# Altium schematic sheet 31_Power2.SchDoc: Board power supply 2
size A3; Organization: Lime Microsystems; Address1: Surrey Tech Centre; Address2: Guildford GU2 7YG; Address3: Surrey; Address4: United Kingdom; Revision: v1.1; SheetNumber: 31; SheetTotal: 31
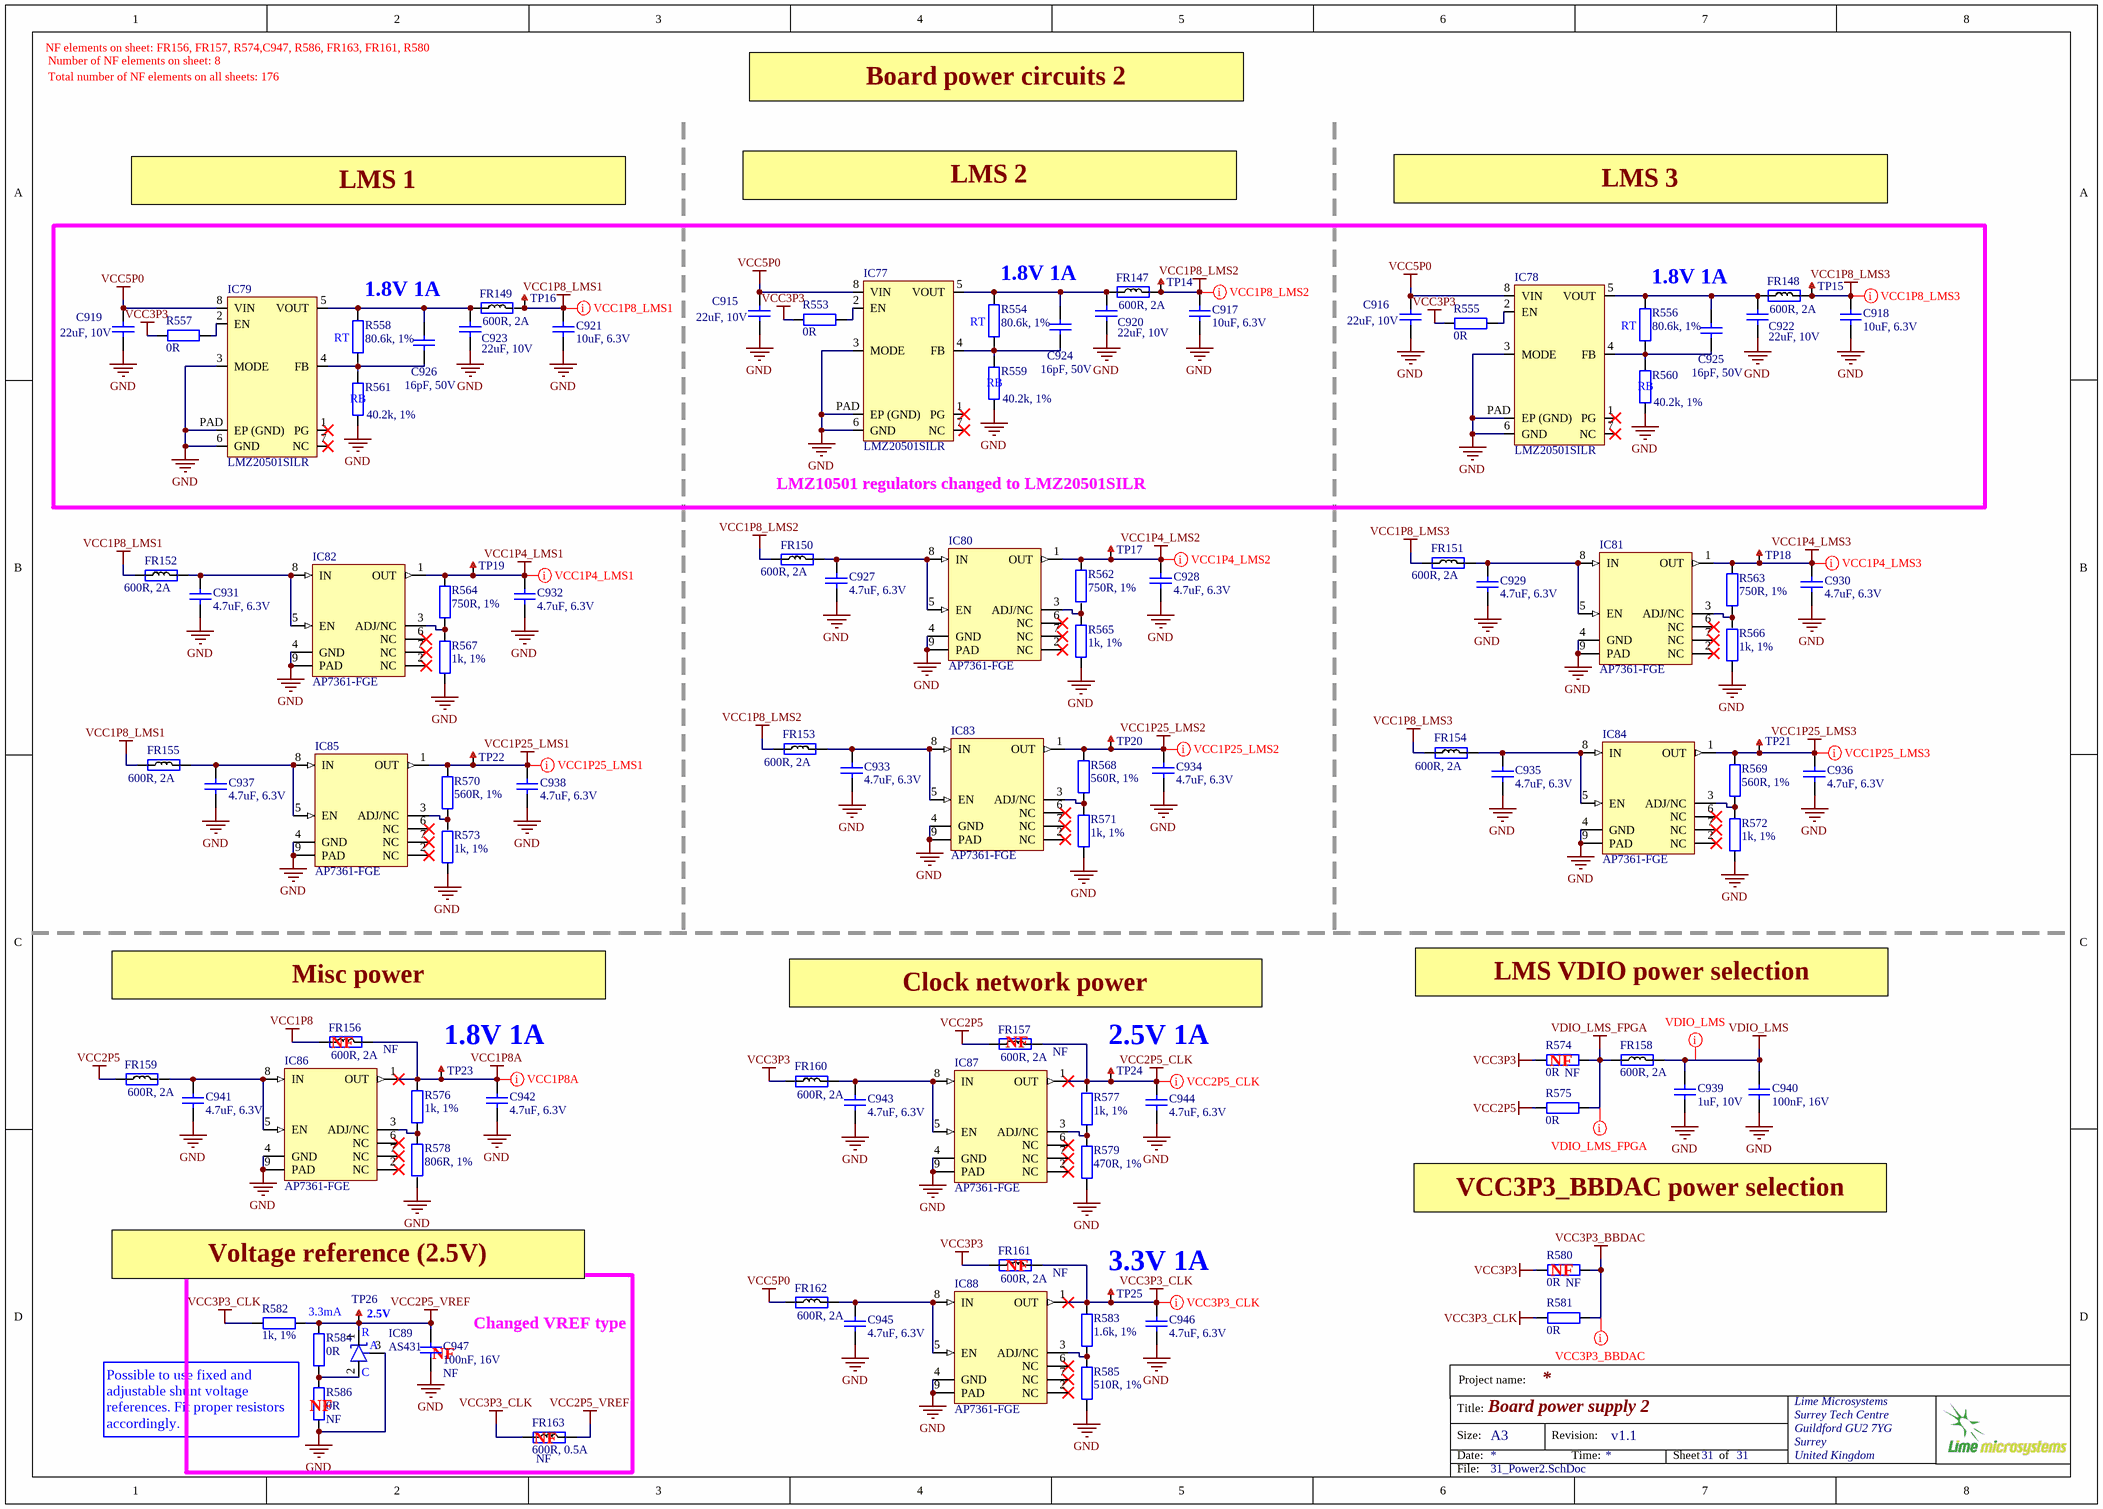
[diagram p0: 31_Power2.SchDoc]

## Parts
C915  22uF, 10V  [CAP0603]
C916  22uF, 10V  [CAP0603]
C917  10uF, 6.3V  [CAP0603]
C918  10uF, 6.3V  [CAP0603]
C919  22uF, 10V  [CAP0603]
C920  22uF, 10V  [CAP0603]
C921  10uF, 6.3V  [CAP0603]
C922  22uF, 10V  [CAP0603]
C923  22uF, 10V  [CAP0603]
C924  16pF, 50V  [CAP0402]
C925  16pF, 50V  [CAP0402]
C926  16pF, 50V  [CAP0402]
C927  4.7uF, 6.3V  [CAP0402]
C928  4.7uF, 6.3V  [CAP0402]
C929  4.7uF, 6.3V  [CAP0402]
C930  4.7uF, 6.3V  [CAP0402]
C931  4.7uF, 6.3V  [CAP0402]
C932  4.7uF, 6.3V  [CAP0402]
C933  4.7uF, 6.3V  [CAP0402]
C934  4.7uF, 6.3V  [CAP0402]
C935  4.7uF, 6.3V  [CAP0402]
C936  4.7uF, 6.3V  [CAP0402]
C937  4.7uF, 6.3V  [CAP0402]
C938  4.7uF, 6.3V  [CAP0402]
C939  1uF, 10V  [CAP0402]
C940  100nF, 16V  [CAP0402]
C941  4.7uF, 6.3V  [CAP0402]
C942  4.7uF, 6.3V  [CAP0402]
C943  4.7uF, 6.3V  [CAP0402]
C944  4.7uF, 6.3V  [CAP0402]
C945  4.7uF, 6.3V  [CAP0402]
C946  4.7uF, 6.3V  [CAP0402]
C947  100nF, 16V  Assembly Info: NF  [CAP0402]
FR147  600R, 2A  [RES0805]
FR148  600R, 2A  [RES0805]
FR149  600R, 2A  [RES0805]
FR150  600R, 2A  [RES0805]
FR151  600R, 2A  [RES0805]
FR152  600R, 2A  [RES0805]
FR153  600R, 2A  [RES0805]
FR154  600R, 2A  [RES0805]
FR155  600R, 2A  [RES0805]
FR156  600R, 2A  Assembly Info: NF  [RES0805]
FR157  600R, 2A  Assembly Info: NF  [RES0805]
FR158  600R, 2A  [RES0805]
FR159  600R, 2A  [RES0805]
FR160  600R, 2A  [RES0805]
FR161  600R, 2A  Assembly Info: NF  [RES0805]
FR162  600R, 2A  [RES0805]
FR163  value 600R, 0.5A  Assembly Info: NF  [RES0402]  (hidden comment: Ferrite)
IC77  LMZ20501SILR  [LMZ20501SILR_DC-DC_8-SMD]
IC78  LMZ20501SILR  [LMZ20501SILR_DC-DC_8-SMD]
IC79  LMZ20501SILR  [LMZ20501SILR_DC-DC_8-SMD]
IC80  AP7361-FGE  [AP7361]
IC81  AP7361-FGE  [AP7361]
IC82  AP7361-FGE  [AP7361]
IC83  AP7361-FGE  [AP7361]
IC84  AP7361-FGE  [AP7361]
IC85  AP7361-FGE  [AP7361]
IC86  AP7361-FGE  [AP7361]
IC87  AP7361-FGE  [AP7361]
IC88  AP7361-FGE  [AP7361]
IC89  AS431  [SOT23-3_v2]
R553  0R  [RES0402]
R554  80.6k, 1%  [RES0402]
R555  0R  [RES0402]
R556  80.6k, 1%  [RES0402]
R557  0R  [RES0402]
R558  80.6k, 1%  [RES0402]
R559  40.2k, 1%  [RES0402]
R560  40.2k, 1%  [RES0402]
R561  40.2k, 1%  [RES0402]
R562  750R, 1%  [RES0402]
R563  750R, 1%  [RES0402]
R564  750R, 1%  [RES0402]
R565  1k, 1%  [RES0402]
R566  1k, 1%  [RES0402]
R567  1k, 1%  [RES0402]
R568  560R, 1%  [RES0402]
R569  560R, 1%  [RES0402]
R570  560R, 1%  [RES0402]
R571  1k, 1%  [RES0402]
R572  1k, 1%  [RES0402]
R573  1k, 1%  [RES0402]
R574  0R  Assembly Info: NF  [RES0402]
R575  0R  [RES0402]
R576  1k, 1%  [RES0402]
R577  1k, 1%  [RES0402]
R578  806R, 1%  [RES0402]
R579  470R, 1%  [RES0402]
R580  0R  Assembly Info: NF  [RES0402]
R581  0R  [RES0402]
R582  1k, 1%  [RES0402]
R583  1.6k, 1%  [RES0402]
R584  0R  [RES0402]
R585  510R, 1%  [RES0402]
R586  0R  Assembly Info: NF  [RES0402]
TP14  TESTPOINT_PAD  [TP_PAD_1p5MM]  (value not drawn)  (no BOM)
TP15  TESTPOINT_PAD  [TP_PAD_1p5MM]  (value not drawn)  (no BOM)
TP16  TESTPOINT_PAD  [TP_PAD_1p5MM]  (value not drawn)  (no BOM)
TP17  TESTPOINT_PAD  [TP_PAD_1p5MM]  (value not drawn)  (no BOM)
TP18  TESTPOINT_PAD  [TP_PAD_1p5MM]  (value not drawn)  (no BOM)
TP19  TESTPOINT_PAD  [TP_PAD_1p5MM]  (value not drawn)  (no BOM)
TP20  TESTPOINT_PAD  [TP_PAD_1p5MM]  (value not drawn)  (no BOM)
TP21  TESTPOINT_PAD  [TP_PAD_1p5MM]  (value not drawn)  (no BOM)
TP22  TESTPOINT_PAD  [TP_PAD_1p5MM]  (value not drawn)  (no BOM)
TP23  TESTPOINT_PAD  [TP_PAD_1p5MM]  (value not drawn)  (no BOM)
TP24  TESTPOINT_PAD  [TP_PAD_1p5MM]  (value not drawn)  (no BOM)
TP25  TESTPOINT_PAD  [TP_PAD_1p5MM]  (value not drawn)  (no BOM)
TP26  TESTPOINT_PAD  [TP_PAD_1p5MM]  (value not drawn)  (no BOM)

## Blocks framed on the sheet
Changed VREF type: C947 FR163 IC89 R582 R584 R586 TP26

## Nets
GND: C915.1 C916.1 C917.1 C918.1 C919.1 C920.1 C921.1 C922.1 C923.1 C927.1 C928.1 C929.1 C930.1 C931.1 C932.1 C933.1 C934.1 C935.1 C936.1 C937.1 C938.1 C939.1 C940.2 C941.1 C942.1 C943.1 C944.1 C945.1 C946.1 C947.1 IC77.3(MODE) IC77.6(GND) IC77.PAD(EP_(GND)) IC78.3(MODE) IC78.6(GND) IC78.PAD(EP_(GND)) IC79.3(MODE) IC79.6(GND) IC79.PAD(EP_(GND)) IC80.4(GND) IC80.9(PAD) IC81.4(GND) IC81.9(PAD) IC82.4(GND) IC82.9(PAD) IC83.4(GND) IC83.9(PAD) IC84.4(GND) IC84.9(PAD) IC85.4(GND) IC85.9(PAD) IC86.4(GND) IC86.9(PAD) IC87.4(GND) IC87.9(PAD) IC88.4(GND) IC88.9(PAD) IC89.3(NC/A) R559.1 R560.1 R561.1 R565.1 R566.1 R567.1 R571.1 R572.1 R573.1 R578.2 R579.2 R585.2 R586.2
VCC1P4_LMS1: C932.2 IC82.1(OUT) R564.1 TP19.1
VCC1P4_LMS2: C928.2 IC80.1(OUT) R562.1 TP17.1
VCC1P4_LMS3: C930.2 IC81.1(OUT) R563.1 TP18.1
VCC1P8: FR156.1
VCC1P8_LMS1: C921.2 FR149.2 FR152.1 FR155.1 TP16.1
VCC1P8_LMS2: C917.2 FR147.2 FR150.1 FR153.1 TP14.1
VCC1P8_LMS3: C918.2 FR148.2 FR151.1 FR154.1 TP15.1
VCC1P8A: C942.2 FR156.2 IC86.1(OUT) R576.2 TP23.1
VCC1P25_LMS1: C938.2 IC85.1(OUT) R570.2 TP22.1
VCC1P25_LMS2: C934.2 IC83.1(OUT) R568.2 TP20.1
VCC1P25_LMS3: C936.2 IC84.1(OUT) R569.2 TP21.1
VCC2P5: FR157.1 FR159.1 R575.2
VCC2P5_CLK: C944.2 FR157.2 IC87.1(OUT) R577.2 TP24.1
VCC2P5_VREF: C947.2 FR163.2 IC89.1(K) R582.1 R584.1 TP26.1
VCC3P3: FR160.1 FR161.1 R553.1 R555.1 R557.1 R574.2 R580.2
VCC3P3_BBDAC: R580.1 R581.1
VCC3P3_CLK: C946.2 FR161.2 FR163.1 IC88.1(OUT) R581.2 R582.2 R583.2 TP25.1
VCC5P0: C915.2 C916.2 C919.2 FR162.1 IC77.8(VIN) IC78.8(VIN) IC79.8(VIN)
VDIO_LMS: C939.2 C940.1 FR158.2
VDIO_LMS_FPGA: FR158.1 R574.1 R575.1
NetC920_2: C920.2 C924.1 FR147.1 IC77.5(VOUT) R554.2
NetC922_2: C922.2 C925.1 FR148.1 IC78.5(VOUT) R556.2
NetC923_2: C923.2 C926.1 FR149.1 IC79.5(VOUT) R558.2
NetC924_2: C924.2 IC77.4(FB) R554.1 R559.2
NetC925_2: C925.2 IC78.4(FB) R556.1 R560.2
NetC926_2: C926.2 IC79.4(FB) R558.1 R561.2
NetC927_2: C927.2 FR150.2 IC80.5(EN) IC80.8(IN)
NetC929_2: C929.2 FR151.2 IC81.5(EN) IC81.8(IN)
NetC931_2: C931.2 FR152.2 IC82.5(EN) IC82.8(IN)
NetC933_2: C933.2 FR153.2 IC83.5(EN) IC83.8(IN)
NetC935_2: C935.2 FR154.2 IC84.5(EN) IC84.8(IN)
NetC937_2: C937.2 FR155.2 IC85.5(EN) IC85.8(IN)
NetC941_2: C941.2 FR159.2 IC86.5(EN) IC86.8(IN)
NetC943_2: C943.2 FR160.2 IC87.5(EN) IC87.8(IN)
NetC945_2: C945.2 FR162.2 IC88.5(EN) IC88.8(IN)
NetIC77_2: IC77.2(EN) R553.2
NetIC78_2: IC78.2(EN) R555.2
NetIC79_2: IC79.2(EN) R557.2
NetIC80_3: IC80.3(ADJ/NC) R562.2 R565.2
NetIC81_3: IC81.3(ADJ/NC) R563.2 R566.2
NetIC82_3: IC82.3(ADJ/NC) R564.2 R567.2
NetIC83_3: IC83.3(ADJ/NC) R568.1 R571.2
NetIC84_3: IC84.3(ADJ/NC) R569.1 R572.2
NetIC85_3: IC85.3(ADJ/NC) R570.1 R573.2
NetIC86_3: IC86.3(ADJ/NC) R576.1 R578.1
NetIC87_3: IC87.3(ADJ/NC) R577.1 R579.1
NetIC88_3: IC88.3(ADJ/NC) R583.1 R585.1
NetIC89_2: IC89.2(A) R584.2 R586.1

Not connected (* = marked no-connect by the designer): IC77 1(PG)* 7(NC)*; IC78 1(PG)* 7(NC)*; IC79 1(PG)* 7(NC)*; IC80 2(NC)* 6(NC)* 7(NC)*; IC81 2(NC)* 6(NC)* 7(NC)*; IC82 2(NC)* 6(NC)* 7(NC)*; IC83 2(NC)* 6(NC)* 7(NC)*; IC84 2(NC)* 6(NC)* 7(NC)*; IC85 2(NC)* 6(NC)* 7(NC)*; IC86 2(NC)* 6(NC)* 7(NC)*; IC87 2(NC)* 6(NC)* 7(NC)*; IC88 2(NC)* 6(NC)* 7(NC)*

## Layout directives
net class VCC1P4_LMS1: VCC1P4_LMS1
net class VCC1P25_LMS1: VCC1P25_LMS1
net class VCC1P4_LMS2: VCC1P4_LMS2
net class VCC1P25_LMS2: VCC1P25_LMS2
net class VDIO_LMS: VDIO_LMS
net class VDIO_LMS_FPGA: VDIO_LMS_FPGA
net class VCC1P4_LMS3: VCC1P4_LMS3
net class VCC1P25_LMS3: VCC1P25_LMS3
net class VCC1P8A: VCC1P8A
net class VCC3P3_CLK: VCC3P3_CLK
net class VCC2P5_CLK: VCC2P5_CLK
net class VCC3P3_BBDAC: VCC3P3_BBDAC
net class VCC1P8_LMS1: VCC1P8_LMS1
net class VCC1P8_LMS2: VCC1P8_LMS2
net class VCC1P8_LMS3: VCC1P8_LMS3

## Notes on the sheet
- NF elements on sheet: FR156, FR157, R574,C947, R586, FR163, FR161, R580
- Number of NF elements on sheet: 8
- Total number of NF elements on all sheets: 176
- Board power circuits 2
- LMS 1
- LMS 2
- LMS 3
- (near R558) 1.8V 1A
- (near R554) 1.8V 1A
- (near R556) 1.8V 1A
- RT
- (near R561) RB
- (near R559) RB
- (near R560) RB
- LMZ10501 regulators changed to LMZ20501SILR
- LMS VDIO power selection
- Misc power
- (near FR156) NF
- (near TP23) 1.8V 1A
- (near FR157) Clock network power
- (near FR157) NF
- (near TP24) 2.5V 1A
- (near R574) NF
- VCC3P3_BBDAC power selection
- Voltage reference (2.5V)
- 3.3mA
- (near TP26) 2.5V
- (near FR161) NF
- (near TP25) 3.3V 1A
- (near R580) NF
- (near IC89) C
- (near IC89) R
- (near IC89) A
- (near C947) NF
- Possible to use fixed and adjustable shunt voltage references. Fit proper resistors accordingly.
- (near R586) NF
- (near FR163) NF
- Project name:
- Title:
- Size:
- Date:
- A3
- Revision:
- Time:
- Sheet
- of
- File:

## Library data of the parts
C915 C916 C919 C920 C922 C923 = Cap_0603: Manufacturer Part Number 1: C1608X5R1A226M080AC; Manufacturer: TDK Corporation; Part Description: 22µF ±20% 10V X5R Ceramic Capacitor -55°C ~ 85°C Surface Mount, MLCC 0603 (1608 Metric) 0.063" L x 0.031" W (1.60mm x 0.80mm); Brand: TDK; Temperature Coefficient / Code: +/- 15 %; Tolerance: 20 %; Type: Multilayer Ceramic Chip Capacitor; Supplier 1: Mouser; Supplier Part Number 1: 810-C1608X5R1A226M; Package / Case: 0603 (1608 metric); Category: Multilayer Ceramic Capacitors MLCC - SMD/SMT; Capacitance: 22 uF; Operating Temperature Range: - 55 C to + 85 C; Case Code - in: 0603; Voltage Rating DC: 10 V; Case Code - mm: 1608; Value: 22uF, 10V
C917 C918 C921 = Cap_0603: Manufacturer Part Number 1: CC0603MRX5R5BB106; Manufacturer: Yageo; Part Description: 10µF ±20% 6.3V X5R Ceramic Capacitor -55°C ~ 85°C Surface Mount, MLCC 0603 (1608 Metric) 0.063" L x 0.031" W (1.60mm x 0.80mm); Capacitance: 10µF; Tolerance: ±20%; Supplier 1: Digi-Key; Supplier Part Number 1: 311-1448-2-ND; Package / Case: 0603 (1608 Metric); Category: Capacitors; Voltage - Rated: 6.3V; Value: 10uF, 6.3V
C924-C926 = Cap_0402: Part Description: 16 pF ±5% 50V Ceramic Capacitor C0G, NP0 0402 (1005 Metric); Manufacturer: Yageo; Manufacturer Part Number 1: CC0402JRNPO9BN160; Tolerance: 5%; Dielectric: C0G; Value: 16pF, 50V; Supplier 1: Digi-Key; Supplier Part Number 1: 311-1662-1-ND; Stock 1: 168271; Pricing 1: 1=0,10000, 10=0,03700, 50=0,02020, 100=0,01640, 500=0,01174, 1000=0,00922, 2500=0,00838, 5000=0,00771 (USD); RoHS: Yes; Mount: Surface Mount; Case/Package: 0402; Case Code (Imperial): 0402; Case Code (Metric): 1005; Weight: 2.3E-05oz; Min Operating Temperature: -55°C; Max Operating Temperature: 125°C; Capacitance: 16pF; Packaging: Tape and Reel; Voltage Rating (DC): 50V; Voltage Rating: 50V; Termination: SMD/SMT; Resistor Type: Ceramic; Series: CC; Length: 0.039inch; Width: 0.02inch; Thickness: 0.022inch; Depth: 0.5mm; Lead Free: Lead Free; RoHS Compliant: Yes; ComponentLink1URL: http://www.mouser.com/ds/2/447/Yageo_UPY-GP_NP0_16V-to-50V_9-358835.pdf?src-supplier=Mouser; ComponentLink1Description: http://www.mouser.com/ds/2/447/Yageo_UPY-GP_NP0_16V-to-50V_9-358835.pdf?src-supplier=Mouser; ComponentLink2URL: http://www.yageo.com/documents/recent/UPY-GP_NP0_16V-to-50V_16.pdf?src-supplier=Digi-Key; ComponentLink2Description: http://www.yageo.com/documents/recent/UPY-GP_NP0_16V-to-50V_16.pdf?src-supplier=Digi-Key
C927-C938 C943-C946 = Cap_0402: Manufacturer: Murata Electronics North America; Manufacturer Part Number 1: GRM155R60J475ME87D; Part Description: 4.7µF ±20% 6.3V X5R Ceramic Capacitor -55°C ~ 85°C Surface Mount, MLCC 0402 (1005 Metric) 0.039" L x 0.020" W (1.00mm x 0.50mm); Tolerance: ±20%; Capacitance: 4.7µF; Temperature Coefficient: X5R; Lead Style: -; Ratings: -; Height - Seated (Max): -; Thickness (Max): 0.022" (0.55mm); Voltage - Rated: 6.3V; Packaging: Cut Tape (CT); Lead Spacing: -; Category: Capacitors; Supplier Part Number 1: 490-5408-1-ND; Applications: General Purpose; Operating Temperature: -55°C ~ 85°C; Mounting Type: Surface Mount, MLCC; Features: Derating Recommended; RoHS: RoHS Compliant; Supplier 1: Digi-Key; Package / Case: 0402 (1005 Metric); Size / Dimension: 0.039" L x 0.020" W (1.00mm x 0.50mm); Value: 4.7uF, 6.3V
C939 = Cap_0402: Manufacturer Part Number 1: C1005X5R1E105K050BC; Manufacturer: TDK; Part Description: 1µF ±10% 10V X5R Ceramic Capacitor -55°C ~ 85°C Surface Mount, MLCC 0402 (1005 Metric) 0.039" L x 0.020" W (1.00mm x 0.50mm); Voltage Rating: 10; Capacitance Tolerance: ± 10%; Product Range: TDK - C Series; Ceramic Capacitor Case: 0402 [1005 Metric]; Capacitance: 1; Dielectric Characteristic: X6; Value: 1uF, 10V; Supplier 1: Digi-Key; Supplier Part Number 1: 445-9066-1-ND; MSL: -; RoHS: YES
C940 = Cap_0402: Manufacturer: Murata Electronics; Manufacturer Part Number 1: GRM155R71C104KA88D; Part Description: 0.10µF ±10% 16V X7R Ceramic Capacitor -55°C ~ 125°C Surface Mount, MLCC 0402 (1005 Metric) 0.039" L x 0.020" W (1.00mm x 0.50mm); Tolerance: 10 %; Type: General Purpose MLCC; Capacitance: 0.1 uF; Case Length: 1 mm; Dielectric: X7R; Case Height: 0.5 mm; Temperature Coefficient / Code: +/- 15 %; Value: 100nF, 16V; Supplier 1: Mouser; Supplier Part Number 1: 81-GRM155R71C104KA88; Case Code - in: 0402; RoHS: RoHS Compliant; Operating Temperature Range: - 55 C to + 125 C; Series: GRM; Termination Style: SMD/SMT; Package / Case: 0402 (1005 metric); Voltage Rating DC: 16 V; Maximum Operating Temperature: + 125 C; Case Code - mm: 1005; Minimum Operating Temperature: - 55 C; Product Category: Low & Medium Capacitance SMD Ceramic Chip Capacitors; Packaging: Reel; Product: General Type MLCCs; Category: Multilayer Ceramic Capacitors MLCC - SMD/SMT; Brand: Murata Electronics; Case Width: 0.5 mm; RoHS - Mouser: Y; Standard Pack Qty: 10000; Minimum Order Quantity: 1; Reeling: True
C941 C942 = Cap_0402: Manufacturer Part Number 1: GRM155R60J475ME87D; Manufacturer: Murata Electronics North America; Part Description: 4.7µF ±20% 6.3V X5R Ceramic Capacitor -55°C ~ 85°C Surface Mount, MLCC 0402 (1005 Metric) 0.039" L x 0.020" W (1.00mm x 0.50mm); Temperature Coefficient: X5R; Capacitance: 4.7µF; Tolerance: ±20%; Value: 4.7uF, 6.3V; Supplier 1: Digi-Key; Supplier Part Number 1: 490-5408-1-ND; Category: Capacitors; Voltage - Rated: 6.3V; Thickness (Max): 0.022" (0.55mm); Applications: General Purpose; Package / Case: 0402 (1005 Metric); Size / Dimension: 0.039" L x 0.020" W (1.00mm x 0.50mm); Features: Derating Recommended; Mounting Type: Surface Mount, MLCC; Ratings: -; Lead Style: -; Operating Temperature: -55°C ~ 85°C; Lead Spacing: -; RoHS: RoHS Compliant; Height - Seated (Max): -; Packaging: Cut Tape (CT)
C947 = Cap_0603: Manufacturer Part Number 1: GRM155R71C104KA88D; Part Description: 0.10µF ±10% 16V X7R Ceramic Capacitor -55°C ~ 125°C Surface Mount, MLCC 0402 (1005 Metric) 0.039" L x 0.020" W (1.00mm x 0.50mm); Brand: Murata Electronics; Tolerance: 10 %; Type: General Purpose MLCC; Capacitance: 0.1 uF; Temperature Coefficient / Code: +/- 15 %; Case Height: 0.5 mm; Case Length: 1 mm; Dielectric: X7R; Supplier 1: Mouser; Supplier Part Number 1: 81-GRM155R71C104KA88; Case Code - in: 0402; Manufacturer: Murata Electronics; Category: Multilayer Ceramic Capacitors MLCC - SMD/SMT; Voltage Rating DC: 16 V; Value: 100nF, 16V; Case Code - mm: 1005; Case Width: 0.5 mm; Maximum Operating Temperature: + 125 C; Minimum Operating Temperature: - 55 C; Minimum Order Quantity: 1; Operating Temperature Range: - 55 C to + 125 C; Package / Case: 0402 (1005 metric); Packaging: Reel; Product: General Type MLCCs; Product Category: Low & Medium Capacitance SMD Ceramic Chip Capacitors; Reeling: True; RoHS - Mouser: Y; RoHS: RoHS Compliant; Series: GRM; Standard Pack Qty: 10000; Termination Style: SMD/SMT
FR147-FR162 = Ferrite: Manufacturer Part Number 1: MPZ2012S601AT000; Manufacturer: TDK Corporation; Part Description: FERRITE BEAD 600 OHM 0805 1LN; Filter Type: Differential Mode - Single; Impedance @ Frequency: 600 Ohm @ 100MHz; DC Resistance (DCR): 100 mOhm Max; Supplier 1: Digi-Key; Supplier Part Number 1: 445-2206-2-ND; Mounting Type: Surface Mount; RoHS: RoHS Compliant; Height (Max): 0.041" (1.05mm); Packaging: Tape & Reel (TR); Category: Filters; Current Rating: 2A; Package / Case: 0805 (2012 Metric); Size / Dimension: 0.079" L x 0.049" W (2.00mm x 1.25mm); Value: 600R, 2A
FR163 = Ferrite: Manufacturer: Murata; Manufacturer Part Number 1: BLM15AX601SN1D; Part Description: - Ferrite Bead 0402 (1005 Metric) 500mA 340mOhm; Tolerance: 25%; Impedance: 600R; Current Rating: 500mA; Number of Lines: 1; DC Resistance (DCR): 340mR; Test Frequency: 100MHz; Supplier 1: Digi-Key; Supplier Part Number 1: 490-5441-1-ND; Stock 1: 416370; Pricing 1: 1=0.1, 10=0.06, 25=0.0552, 50=0.0496, 100=0.0363, 250=0.0264, 500=0.0242, 1000=0.0209, 5000=0.0165 (USD); Case/Package: 0402; Number of Pins: 2; Case Code (Metric): 1005; Case Code (Imperial): 0402; Core Material: Ferrite; Material: Steel,Ferrite; Min Operating Temperature: -55°C; Max Operating Temperature: 125°C; Package Quantity: 1; Packaging: Tape and Reel; Series: BLM15AX_SN; Max Current Rating: 500mA; Termination: SMD/SMT; Max DC Current: 500mA; Number of Circuits: 1; DC Resistance-Max: 340mR; Length: 1mm; Width: 0.5mm; Height: 0.5mm; Depth: 0.5mm; REACH SVHC: No SVHC; Lead Free: Lead Free; RoHS Compliant: Yes; ComponentLink1URL: https://www.murata.com/en-us/products/productdata/8796740059166/ENFA0018.pdf?src-supplier=Digi-Key; ComponentLink1Description: https://www.murata.com/en-us/products/productdata/8796740059166/ENFA0018.pdf?src-supplier=Digi-Key; ComponentLink2URL: http://search.murata.co.jp/Ceramy/image/img/PDF/ENG/L0110S0100BLM15AX_SN.pdf?src-supplier=Future+Electronics; ComponentLink2Description: http://search.murata.co.jp/Ceramy/image/img/PDF/ENG/L0110S0100BLM15AX_SN.pdf?src-supplier=Future+Electronics; ComponentLink3URL: http://www.produktinfo.conrad.com/datenblaetter/1100000-1199999/001171675-da-01-en-CHIP_DROSSEL0402_600R_420MA_1_0X0_5MM.pdf?src-supplier=Conrad; ComponentLink3Description: http://www.produktinfo.conrad.com/datenblaetter/1100000-1199999/001171675-da-01-en-CHIP_DROSSEL0402_600R_420MA_1_0X0_5MM.pdf?src-supplier=Conrad; ComponentLink4URL: http://www.produktinfo.conrad.com/datenblaetter/1100000-1199999/001172169-da-01-en-DROSSEL_0402_600R_1_0X0_5MM_10000ST.pdf?src-supplier=Conrad; ComponentLink4Description: http://www.produktinfo.conrad.com/datenblaetter/1100000-1199999/001172169-da-01-en-DROSSEL_0402_600R_1_0X0_5MM_10000ST.pdf?src-supplier=Conrad
IC77-IC79 = LMZ20501SILR_DC-DC: Manufacturer: Texas Instruments; Part Description: Non-Isolated PoL Module DC DC Converter 1 Output 0.8 ~ 3.6V 1A 2.7V - 5.5V Input; Number of Outputs: 1; Min Input Voltage: 2.7V; Max Input Voltage: 5.5V; Voltage - Output 1: 3.6V; Max Output Current: 1A; Efficiency: 93%; Max Power Dissipation: 4W; Quiescent Current: 72nA; Switching Frequency: 3MHz; Output Type: Adjustable; Supplier 1: Digi-Key; Supplier Part Number 1: 296-40328-1-ND; Manufacturer Part Number 1: LMZ20501SILR; Stock 1: 8106; Pricing 1: 1=4,48000, 10=4,02000, 25=3,80040, 100=3,29350, 250=3,12464, 500=2,80372, 1000=2,54942 (USD); RoHS: Yes; Mount: Surface Mount; Case/Package: SMD/SMT; Number of Pins: 8; Min Operating Temperature: -40°C; Max Operating Temperature: 125°C; Packaging: Tape and Reel; Output Voltage: 3.6V; Package Quantity: 3000; Features: UVLO,OCP,OTP,SCP; Operating Supply Voltage: 5.5V; Length: 0.14inch; Width: 0.14inch; Height: 0.07inch; Lead Free: Lead Free; RoHS Compliant: Yes; ComponentLink1URL: http://www.ti.com/lit/pdf/snaa214?src-supplier=Digi-Key; ComponentLink1Description: http://www.ti.com/lit/pdf/snaa214?src-supplier=Digi-Key; ComponentLink2URL: http://www.ti.com/lit/ds/symlink/lmz20501.pdf?src-supplier=Digi-Key; ComponentLink2Description: http://www.ti.com/lit/ds/symlink/lmz20501.pdf?src-supplier=Digi-Key; ComponentLink3URL: http://www.ti.com/lit/gpn/lmz20501?src-supplier=Mouser; ComponentLink3Description: http://www.ti.com/lit/gpn/lmz20501?src-supplier=Mouser; ComponentLink4URL: http://www.ti.com/general/docs/lit/getliterature.tsp?genericPartNumber=LMZ20501&&fileType=pdf&src-supplier=Avnet; ComponentLink4Description: http://www.ti.com/general/docs/lit/getliterature.tsp?genericPartNumber=LMZ20501&&fileType=pdf&src-supplier=Avnet
IC80-IC85 IC87 IC88 = AP7361: Manufacturer Part Number 1: AP7361-FGE-7; Manufacturer: Diodes Incorporated; Part Description: IC REG LDO ADJ 1A 8DFN; Regulator Topology: Positive Adjustable; Current - Output: 1A; Current - Limit (Min): 1.1A; Voltage - Dropout (Typical): 0.5V @ 1A; Voltage - Output: 0.8 V ~ 5.5 V; Number of Regulators: 1; Voltage - Input: 2.2 V ~ 6 V; Supplier 1: Digi-Key; Supplier Part Number 1: AP7361-FGE-7DICT-ND; RoHS: RoHS Compliant; Supplier Device Package: U-DFN3030-8; Mounting Type: Surface Mount; Category: Integrated Circuits (ICs); Packaging: Cut Tape (CT); Package / Case: 8-UDFN Exposed Pad; Operating Temperature: -40°C ~ 85°C
IC86 = AP7361: Manufacturer: Diodes Incorporated; Part Description: IC REG LDO ADJ 1A 8DFN; Manufacturer Part Number 1: AP7361-FGE-7; Regulator Topology: Positive Adjustable; Current - Output: 1A; Current - Limit (Min): 1.1A; Voltage - Dropout (Typical): 0.5V @ 1A; Voltage - Output: 0.8 V ~ 5.5 V; Number of Regulators: 1; Voltage - Input: 2.2 V ~ 6 V; Supplier 1: Digi-Key; Supplier Part Number 1: AP7361-FGE-7DICT-ND; RoHS: RoHS Compliant; Supplier Device Package: U-DFN3030-8; Mounting Type: Surface Mount; Category: Integrated Circuits (ICs); Packaging: Cut Tape (CT); Package / Case: 8-UDFN Exposed Pad; Operating Temperature: -40°C ~ 85°C
IC89 = VOLTAGE_REFERENCE_UNIVERSAL: Manufacturer: Diodes; Manufacturer Part Number 1: AS431ANTR-G1; Part Description: Shunt Voltage Reference IC Adjustable 2.5V 36 VV ±0.5% 100 mA SOT-23-3; Cathode Current: 1mA; Max Input Voltage: 36V; Max Output Current: 100mA; Min Output Voltage: 2.5V; Output Type: Adjustable; Reference Type: Shunt; Temperature Coefficient: 20ppm/°C; Tolerance: 0.5%; ComponentLink1URL: https://datasheet.ciiva.com/1177/1643148-1177233.pdf?src-supplier=Avnet; ComponentLink1Description: https://datasheet.ciiva.com/1177/1643148-1177233.pdf?src-supplier=Avnet; Case/Package: TO-236-3; ComponentLink2Description: https://datasheet.ciiva.com/30002/as431-30002029.pdf?src-supplier=Avnet; ComponentLink2URL: https://datasheet.ciiva.com/30002/as431-30002029.pdf?src-supplier=Avnet; ComponentLink3Description: https://datasheet.ciiva.com/29572/as431-29572149.pdf?src-supplier=Digi-Key; ComponentLink3URL: https://datasheet.ciiva.com/29572/as431-29572149.pdf?src-supplier=Digi-Key; ComponentLink4Description: https://datasheet.ciiva.com/29572/as431-29572150.pdf?src-supplier=Digi-Key; ComponentLink4URL: https://datasheet.ciiva.com/29572/as431-29572150.pdf?src-supplier=Digi-Key; Max Operating Temperature: 125°C; Max Output Voltage: 36V; Min Operating Temperature: -40°C; Mount: Surface Mount; Number of Pins: 3; Output Current: 100mA; Output Voltage: 36V; Package Quantity: 3000; Packaging: Tape and Reel; Pricing 1: 1=0,36000, 10=0,27000, 25=0,23600, 100=0,15270, 250=0,12640, 500=0,10112, 1000=0,07753 (USD); Radiation Hardening: No; RoHS: Yes; RoHS Compliant: Yes; Stock 1: 792556; Supplier 1: Digi-Key; Supplier Part Number 1: AS431ANTR-G1DICT-ND
R553 R555 R557 R574 R575 R580 R581 R584 R586 = Res_0402: Manufacturer Part Number 1: RC0402JR-070RL; Manufacturer: Yageo; Part Description: RES SMD 0.0OHM JUMPER 1/16W 0402; Resistance (Ohms): 0.0; Tolerance: Jumper; Power (Watts): 0.063W, 1/16W; Value: 0R; Supplier 1: Digi-Key; Supplier Part Number 1: 311-0.0JRTR-ND; Category: Resistors; Temperature Coefficient: -; Features: Moisture Resistant; Supplier Device Package: 0402; Height: 0.016" (0.40mm); Package / Case: 0402 (1005 Metric); Operating Temperature: -55°C ~ 155°C; Size / Dimension: 0.039" L x 0.020" W (1.00mm x 0.50mm); Composition: Thick Film; Packaging: Tape & Reel (TR); Number of Terminations: 2; RoHS: RoHS Compliant
R554 R556 R558 = Res_0402: Part Description: 80.6 kOhms ±1% 0.063W, 1/16W Chip Resistor 0402 (1005 Metric) Automotive AEC-Q200 Thick Film; Manufacturer: Stackpole Electronics; Manufacturer Part Number 1: RMCF0402FT80K6; Resistance: 80.6kR; Max Power Dissipation: 63mW; Temperature Coefficient: 100ppm/°C; Value: 80.6k, 1%; Supplier 1: Digi-Key; Supplier Part Number 1: RMCF0402FT80K6CT-ND; Stock 1: 329079; Pricing 1: 1=0,10000, 10=0,01300, 100=0,00550, 1000=0,00246, 2500=0,00213, 5000=0,00176 (USD); RoHS: Yes; Mount: Surface Mount; Case/Package: 0402; Case Code (Metric): 1005; Case Code (Imperial): 0402; Contact Plating: Tin,Matte; Min Operating Temperature: -55°C; Max Operating Temperature: 155°C; Tolerance: 1%; Features: Automotive AEC-Q200; Packaging: Tape and Reel; Resistor Type: Thick Film; Number of Terminations: 2; Series: RMCF; Length: 0.039inch; Width: 0.02inch; Height: 0.016inch; Radiation Hardening: No; Lead Free: Lead Free; RoHS Compliant: Yes; ComponentLink1URL: https://www.seielect.com/catalog/SEI-Packaging.pdf?src-supplier=Digi-Key; ComponentLink1Description: https://www.seielect.com/catalog/SEI-Packaging.pdf?src-supplier=Digi-Key; ComponentLink2URL: https://www.seielect.com/catalog/SEI-RMCF_RMCP.pdf?src-supplier=Avnet; ComponentLink2Description: https://www.seielect.com/catalog/SEI-RMCF_RMCP.pdf?src-supplier=Avnet; ComponentLink3URL: https://www.seielect.com/Catalog/SEI-RMCF_RMCP.pdf?src-supplier=Digi-Key; ComponentLink3Description: https://www.seielect.com/Catalog/SEI-RMCF_RMCP.pdf?src-supplier=Digi-Key
R559-R561 = Res_0402: Part Description: 40.2 kOhms ±1% 0.063W, 1/16W Chip Resistor 0402 (1005 Metric) Moisture Resistant Thick Film; Manufacturer: Yageo; Manufacturer Part Number 1: RC0402FR-0740K2L; Resistance: 40.2kR; Power Rating: 62.5mW; Voltage Rating: 50V; Temperature Coefficient: 100ppm/°C; Max Power Dissipation: 63mW; Value: 40.2k, 1%; Supplier 1: Digi-Key; Supplier Part Number 1: 311-40.2KLRCT-ND; Stock 1: 2895359; Pricing 1: 1=0,10000, 10=0,01500, 100=0,00600, 1000=0,00267, 2500=0,00232, 5000=0,00192 (USD); RoHS: Yes; Case/Package: 0402; Case Code (Metric): 1005; Case Code (Imperial): 0402; Contact Plating: Tin,Matte; Size Code: 0402; Min Operating Temperature: -55°C; Max Operating Temperature: 155°C; Package Quantity: 1; Tolerance: 1%; Packaging: Tape and Reel; Resistor Type: Thick Film; Number of Terminations: 2; Termination: SMD/SMT; Features: Moisture Resistant; Series: RC; Construction: Rectangular; Voltage Rating (DC): 50V; Length: 0.039inch; Width: 0.02inch; Height: 0.016inch; Depth: 0.5mm; Military Standard: Not; Lead Free: Lead Free; RoHS Compliant: Yes; ComponentLink1URL: https://datasheet.ciiva.com/2453/pyu-r-int-thick-7-2453437.pdf?src-supplier=Digi-Key; ComponentLink1Description: https://datasheet.ciiva.com/2453/pyu-r-int-thick-7-2453437.pdf?src-supplier=Digi-Key; ComponentLink2URL: https://datasheet.ciiva.com/2453/pyu-r-int-thick-7-2453438.pdf?src-supplier=Digi-Key; ComponentLink2Description: https://datasheet.ciiva.com/2453/pyu-r-int-thick-7-2453438.pdf?src-supplier=Digi-Key; ComponentLink3URL: https://datasheet.ciiva.com/2453/pyu-r-int-thick-7-2453436.pdf?src-supplier=Digi-Key; ComponentLink3Description: https://datasheet.ciiva.com/2453/pyu-r-int-thick-7-2453436.pdf?src-supplier=Digi-Key; ComponentLink4URL: https://datasheet.ciiva.com/5557/pyu-rc0402-51-rohs-l-6-r-5557981.pdf?src-supplier=Mouser; ComponentLink4Description: https://datasheet.ciiva.com/5557/pyu-rc0402-51-rohs-l-6-r-5557981.pdf?src-supplier=Mouser; ComponentLink5URL: https://datasheet.ciiva.com/8889/pyu-rc0402-51-rohs-l-6-8889263.pdf?src-supplier=Avnet; ComponentLink5Description: https://datasheet.ciiva.com/8889/pyu-rc0402-51-rohs-l-6-8889263.pdf?src-supplier=Avnet; ComponentLink6URL: https://datasheet.ciiva.com/16744/pyu-rc0402-51-rohs-l-6-r-16744286.pdf?src-supplier=Future+Electronics; ComponentLink6Description: https://datasheet.ciiva.com/16744/pyu-rc0402-51-rohs-l-6-r-16744286.pdf?src-supplier=Future+Electronics
R562-R564 = Res_0402: Manufacturer Part Number 1: RC0402FR-07750RL; Manufacturer: Yageo; Part Description: RES SMD 750 OHM 1% 1/16W 0402; Resistance (Ohms): 750; Power (Watts): 0.063W, 1/16W; Temperature Coefficient: ±100ppm/°C; Value: 750R, 1%; Tolerance: ±1%; Number of Terminations: 2; Supplier Device Package: 0402; Size / Dimension: 0.039" L x 0.020" W (1.00mm x 0.50mm); Height: 0.016" (0.40mm); Composition: Thick Film; Features: Moisture Resistant; Operating Temperature: -55°C ~ 155°C; Package / Case: 0402 (1005 Metric); Supplier 1: Digi-Key; RoHS: RoHS Compliant; Category: Resistors; Packaging: Cut Tape (CT); Supplier Part Number 1: 311-750LRCT-ND
R565-R567 R571-R573 R576 R577 R582 = Res_0402: Manufacturer: Stackpole Electronics Inc; Manufacturer Part Number 1: RMCF0402FT1K00; Part Description: RES SMD 1K OHM 1% 1/16W 0402; Temperature Coefficient: ±100ppm/°C; Power (Watts): 0.063W, 1/16W; Value: 1k, 1%; Supplier 1: Digi-Key; Supplier Part Number 1: RMCF0402FT1K00TR-ND; Resistance (Ohms): 1k; Category: Resistors; RoHS: RoHS Compliant; Tolerance: ±1%; Height: 0.016" (0.40mm); Number of Terminations: 2; Package / Case: 0402 (1005 Metric); Operating Temperature: -55°C ~ 155°C; Composition: Thick Film; Supplier Device Package: 0402; Size / Dimension: 0.039" L x 0.020" W (1.00mm x 0.50mm)
  R565-R567 R571-R573 R576 R577: Packaging: Tape & Reel (TR); Features: -
  R582: Packaging: Cut Tape (CT); Features: Moisture Resistant
R568-R570 = Res_0402: Manufacturer Part Number 1: CRCW0402560RFKED; Manufacturer: Vishay Dale; Part Description: RES SMD 560 OHM 1% 1/16W 0402; Resistance (Ohms): 560; Power (Watts): 0.063W, 1/16W; Temperature Coefficient: ±100ppm/°C; RoHS: RoHS Compliant; Packaging: Cut Tape (CT); Composition: Thick Film; Tolerance: ±1%; Number of Terminations: 2; Supplier Device Package: 0402 (1005 Metric); Operating Temperature: -55°C ~ 155°C; Features: Automotive AEC-Q200; Category: Resistors; Supplier Part Number 1: 541-560LCT-ND; Package / Case: 0402 (1005 Metric); Supplier 1: Digi-Key; Height: 0.016" (0.40mm); Size / Dimension: 0.039" L x 0.020" W (1.00mm x 0.50mm)
R578 = Res_0402: Manufacturer Part Number 1: RMCF0402FT806R; Manufacturer: Stackpole Electronics Inc; Part Description: RMCF0402FT806RCT-ND; Resistance (Ohms): 806; Power (Watts): 0.063W, 1/16W; Temperature Coefficient: ±100ppm/°C; Value: 806R, 1%; Supplier 1: Digi-Key; Supplier Part Number 1: RMCF0402FT806RCT-ND; Category: Resistors; Size / Dimension: 0.039" L x 0.020" W (1.00mm x 0.50mm); Tolerance: ±1%; Features: -; Number of Terminations: 2; RoHS: RoHS Compliant; Operating Temperature: -55°C ~ 155°C; Packaging: Cut Tape (CT); Package / Case: 0402 (1005 Metric); Composition: Thick Film; Height: 0.016" (0.40mm); Supplier Device Package: 0402
R579 = Res_0402: Manufacturer: Yageo; Manufacturer Part Number 1: RC0402FR-07470RL; Part Description: 470 Ohms ±1% 0.063W, 1/16W Chip Resistor 0402 (1005 Metric) Moisture Resistant Thick Film; Power Rating: 62.5mW; Temperature Coefficient: 100ppm/°C; Voltage Rating: 50V; Max Power Dissipation: 63mW; Value: 470R, 1%; Supplier 1: Digi-Key; Supplier Part Number 1: 311-470LRCT-ND; Stock 1: 1652476; Pricing 1: 1=0,10000, 10=0,01600, 100=0,00660, 1000=0,00299, 2500=0,00259, 5000=0,00214 (USD); RoHS: Yes; Case/Package: 0402; Case Code (Metric): 1005; Case Code (Imperial): 0402; Size Code: 0402; Min Operating Temperature: -55°C; Max Operating Temperature: 155°C; Packaging: Tape and Reel; Tolerance: 1%; Resistance: 470R; Number of Terminations: 2; Features: Moisture Resistant; Package Quantity: 1; Resistor Type: Thick Film; Termination: SMD/SMT; Series: RC; Resistance Tolerance: 1%; Construction: Rectangular; Length: 1mm; Width: 0.02inch; Height: 0.016inch; Depth: 0.5mm; Lead Free: Lead Free; REACH SVHC: Unknown; Military Standard: Not; RoHS Compliant: Yes
R583 = Res_0402: Manufacturer Part Number 1: RC0402FR-071K6L; Manufacturer: Yageo; Part Description: 1.6 kOhms ±1% 0.063W, 1/16W Chip Resistor 0402 (1005 Metric) Moisture Resistant Thick Film; Temperature Coefficient: ±100ppm/°C; Power (Watts): 0.063W, 1/16W; Value: 1.6k, 1%; Tolerance: ±1%; RoHS: RoHS Compliant; Package / Case: 0402 (1005 Metric); Height - Seated (Max): 0.016" (0.40mm); Supplier Device Package: 0402; Failure Rate: -; Composition: Thick Film; Part Status: Active; Size / Dimension: 0.039" L x 0.020" W (1.00mm x 0.50mm); Operating Temperature: -55°C ~ 155°C; Packaging: Cut Tape (CT); Features: Moisture Resistant; Supplier Part Number 1: YAG3045CT-ND; Category: Resistors; Supplier 1: Digi-Key
R585 = Res_0402: Manufacturer Part Number 1: RC0402FR-07510RL; Manufacturer: Yageo; Part Description: 510 Ohms ±1% 0.063W, 1/16W Chip Resistor 0402 (1005 Metric) Moisture Resistant Thick Film; Temperature Coefficient: ±100ppm/°C; Power (Watts): 0.063W, 1/16W; Value: 510R, 1%; Operating Temperature: -55°C ~ 155°C; Part Status: Active; Tolerance: ±1%; Packaging: Cut Tape (CT); Features: Moisture Resistant; Composition: Thick Film; Supplier Device Package: 0402; Failure Rate: -; Package / Case: 0402 (1005 Metric); Height - Seated (Max): 0.016" (0.40mm); Size / Dimension: 0.039" L x 0.020" W (1.00mm x 0.50mm); Supplier 1: Digi-Key; RoHS: RoHS Compliant; Category: Resistors; Supplier Part Number 1: 311-510LRCT-ND
TP14-TP26 = TESTPOINT_PAD: Test Point PCB mount Miniature White